# EAGLE design espurna-h (EAGLE 8.0.1)
PROJECT_AUTHOR: tinkerman.cat <xose.perez@gmail.com>; PROJECT_LICENSE: CC-BY-SA 3.0; PROJECT_NAME: ESPURNA-H; PROJECT_VERSION: 0.6.20170212
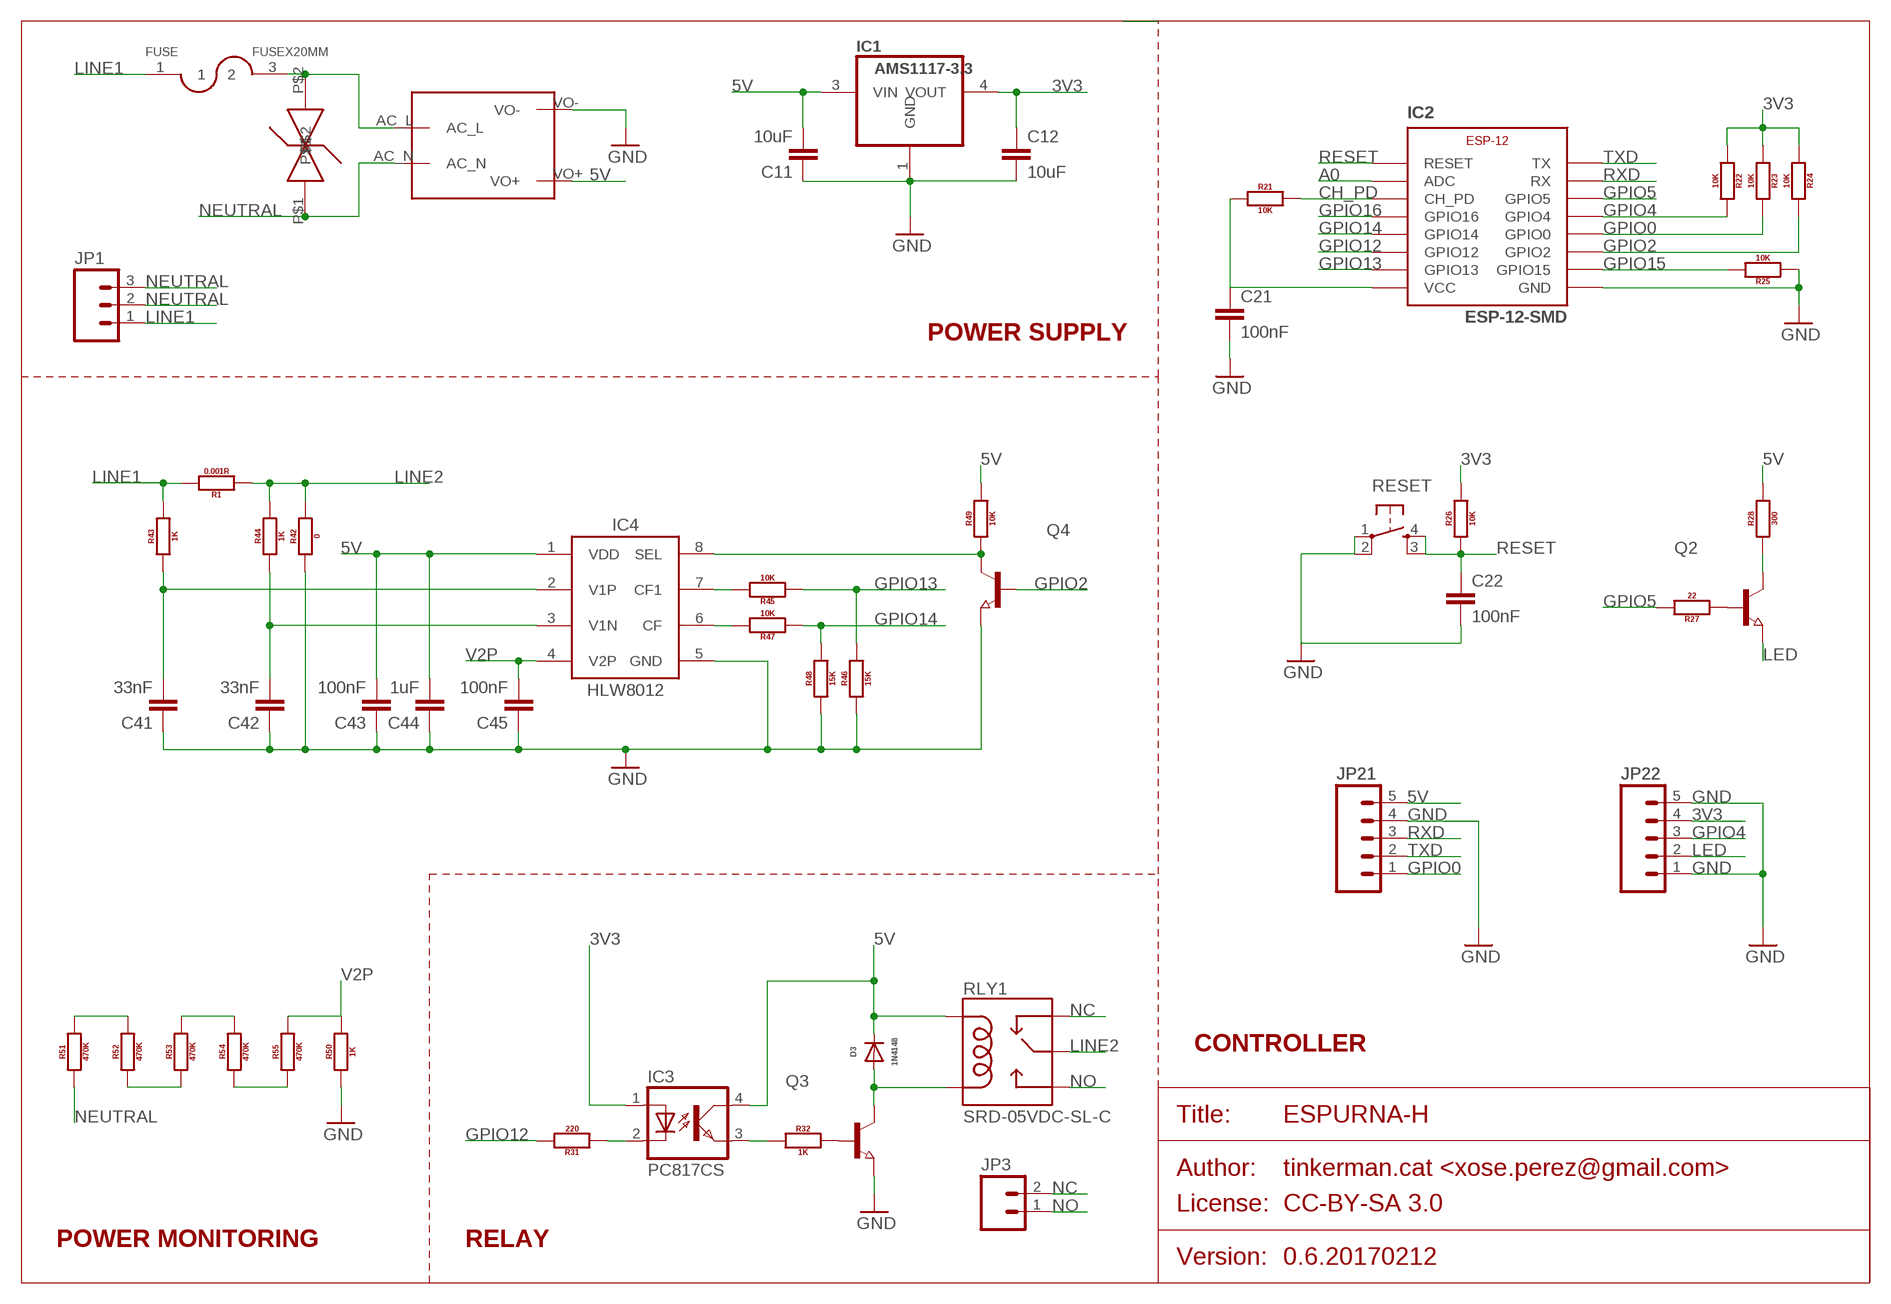
[diagram p0: schematic, sheet 1]

## Parts
C11  10uF  C-EU0805  [0805]
C12  10uF  C-EU0805  [0805]
C21  100nF  C-EU0805  [0805]
C22  100nF  C-EU0805  [0805]
C41  33nF  C-EU0805  [0805]
C42  33nF  C-EU0805  [0805]
C43  100nF  C-EU0805  [0805]
C44  1uF  C-EU0805  [0805]
C45  100nF  C-EU0805  [0805]
D3  1N4148  DIODE  [SOD80]
FUSE  FUSEX20MM  [FUSE_5MM]
IC1  AMS1117-3.3  REG1117SOT223-2  [SOT223]
IC2  ESP-12-SMD  [ESP-12-SMD]
IC3  PC817CS  SFH6186-2  [SMD4-7]
IC4  HLW8012  [SOP8]
JP1  M03200MIL  [SCREWTERMINAL-200MIL-3]
JP3  M02200MIL  [SCREWTERMINAL-200MIL-2]
JP21  M05PTH  [1X05]
JP22  M05PTH  [1X05]
Q2  NPN-TRANSISTOR_SOT23  [SOT23]
Q3  NPN-TRANSISTOR_SOT23  [SOT23]
Q4  NPN-TRANSISTOR_SOT23  [SOT23]
R1  0.001R  RESISTOR2512  [2512]
R21  10K  RESISTOR0805  [0805]
R22  10K  RESISTOR0805  [0805]
R23  10K  RESISTOR0805  [0805]
R24  10K  RESISTOR0805  [0805]
R25  10K  RESISTOR0805  [0805]
R26  10K  RESISTOR0805  [0805]
R27  22  RESISTOR0805  [0805]
R28  300  RESISTOR0805  [0805]
R31  220  RESISTOR0805  [0805]
R32  1K  RESISTOR0805  [0805]
R42  0  RESISTOR1206  [1206]
R43  1K  RESISTOR0805  [0805]
R44  1K  RESISTOR0805  [0805]
R45  10K  RESISTOR0805  [0805]
R46  15K  RESISTOR0805  [0805]
R47  10K  RESISTOR0805  [0805]
R48  15K  RESISTOR0805  [0805]
R49  10K  RESISTOR0805  [0805]
R50  1K  RESISTOR0805  [0805]
R51  470K  RESISTOR0805  [0805]
R52  470K  RESISTOR0805  [0805]
R53  470K  RESISTOR0805  [0805]
R54  470K  RESISTOR0805  [0805]
R55  470K  RESISTOR0805  [0805]
RESET  TACTILE_BUTTON_SMD  [TACTILE-BUTTON-SMD]
RLY1  SRD-05VDC-SL-C  RELAYSONGLE  [SRD-5VDC-SL-C]
U$1  MAINS_CONVERTERS  [HLK-PM01]
VARISTOR  V18ZA2P  [V18ZA2P]

## Nets
3V3: C12.1 C21.1 IC1.4(VOUT) IC2.VCC IC3.1(A) JP22.4 R21.1 R22.1 R23.1 R24.1 R26.2
5V: C11.2 C43.2 C44.2 D3.2(C) IC1.3(VIN) IC3.4(COL) IC4.1(VDD) JP21.5 R28.2 R49.2 RLY1.COIL1 U$1.VO+
A0: IC2.ADC
CH_PD: IC2.CH_PD R21.2
GND: C11.1 C12.2 C21.2 C22.2 C41.1 C42.1 C43.1 C44.1 C45.1 IC1.1(GND) IC2.GND IC4.5(GND) JP21.4 JP22.1 JP22.5 Q3.2(E) Q4.2(E) R25.1 R42.1 R46.1 R48.1 R50.1 RESET.1(SWA1) RESET.2(SWB1) U$1.VO-
GPIO0: IC2.GPIO0 JP21.1 R23.2
GPIO2: IC2.GPIO2 Q4.1(B) R24.2
GPIO4: IC2.GPIO4 JP22.3 R22.2
GPIO5: IC2.GPIO5 R27.2
GPIO12: IC2.GPIO12 R31.2
GPIO13: IC2.GPIO13 R45.1 R46.2
GPIO14: IC2.GPIO14 R47.1 R48.2
GPIO15: IC2.GPIO15 R25.2
GPIO16: IC2.GPIO16
LED: JP22.2 Q2.2(E)
LINE1: FUSE.1 JP1.1 R1.2 R43.2
LINE2: R1.1 R42.2 R44.2 RLY1.COMMON(MAIN)
N$1: Q2.3(C) R28.1
N$3: Q2.1(B) R27.1
N$4: D3.1(A) Q3.3(C) RLY1.COIL2
N$5: Q3.1(B) R32.2
N$6: IC3.3(EMIT) R32.1
N$8: FUSE.3 U$1.AC_L VARISTOR.P$2
N$10: IC4.8(SEL) Q4.3(C) R49.1
N$11: IC4.7(CF1) R45.2
N$12: C41.2 IC4.2(V1P) R43.1
N$13: IC4.6(CF) R47.2
N$14: C42.2 IC4.3(V1N) R44.1
N$15: IC3.2(C) R31.1
N$16: R54.1 R55.1
N$17: R53.2 R54.2
N$18: R52.1 R53.1
N$19: R51.2 R52.2
NC: JP3.2 RLY1.CLOSED(NC)
NEUTRAL: JP1.2 JP1.3 R51.1 U$1.AC_N VARISTOR.P$1
NO: JP3.1 RLY1.OPEN(NO)
RESET: C22.1 IC2.RESET R26.1 RESET.3(SWB2) RESET.4(SWA2)
RXD: IC2.RX JP21.3
TXD: IC2.TX JP21.2
V2P: C45.2 IC4.4(V2P) R50.2 R55.2

## Notes on the sheet
- POWER SUPPLY
- CONTROLLER
- POWER MONITORING | RELAY

## Library data of the parts
C11 C12 C21 C22 C41-C45 = xose:C-EU: CAPACITOR, European symbol
D3 = xose:DIODE
FUSE = xose:FUSE
IC1 = xose:REG1117: 800mA and 1A Low Dropout (LDO) Positive Regulator 1.8V, 2.5V, 2.85V, 3.3V, 5V, and Adj
IC2 = xose:ESP-12
IC3 = optocoupler:SFH618?*: Optocoupler, Phototransistor Output, Low Input Current Source: Data sheet <http://www.vishay.com/docs/83673/sfh618.pdf>; MF: VISHAY/TELEFUNKEN; MPN: SFH6186-2; OC_FARNELL: 1469583; OC_NEWARK: 58K2210
IC4 = xose:HLW8012
JP1 = xose:M03: Header 3 Standard 3-pin 0.1" header. Use with straight break away headers (SKU : PRT-00116), right angle break away headers (PRT-00553), swiss pins (PRT-00743), machine pins (PRT-00117), and female headers (PRT-00115). Molex polarized connector foot print use with SKU : PRT-08232 with associated crimp pins and housings.
JP3 = xose:M02: Standard 2-pin 0.1" header. Use with - straight break away headers ( PRT-00116) - right angle break away headers (PRT-00553) - swiss pins (PRT-00743) - machine pins (PRT-00117) - female headers (PRT-00115) Molex polarized connector foot print use with: PRT-08233 with associated crimp pins and housings. 2.54_SCREWTERM for use with PRT-10571. 3.5mm Screw Terminal footprints for PRT-08084 5mm Screw Terminal footprints for use with PRT-08432
JP21 JP22 = xose:M05: Header 5 Standard 5-pin 0.1" header. Use with straight break away headers (SKU : PRT-00116), right angle break away headers (PRT-00553), swiss pins (PRT-00743), machine pins (PRT-00117), and female headers (PRT-00115). Molex polarized connector foot print use with SKU : PRT-08230 with associated crimp pins and housings.
Q2-Q4 = xose:NPN-TRANSISTOR_: NPN TRANSISTOR
R1 R21-R28 R31 R32 R42-R55 = xose:RESISTOR: Generic EU resistor symbol
RESET = xose:TACTILE_BUTTON: Tactile Button SparkFun Electronics' Tactile Button COM-10302
RLY1 = Spark:RELAY: SPDT relay (COM-00101)
U$1 = captain-slow:MAINS_CONVERTERS
VARISTOR = SparkFun-DiscreteSemi:V18ZA2P: Varistor

## Board
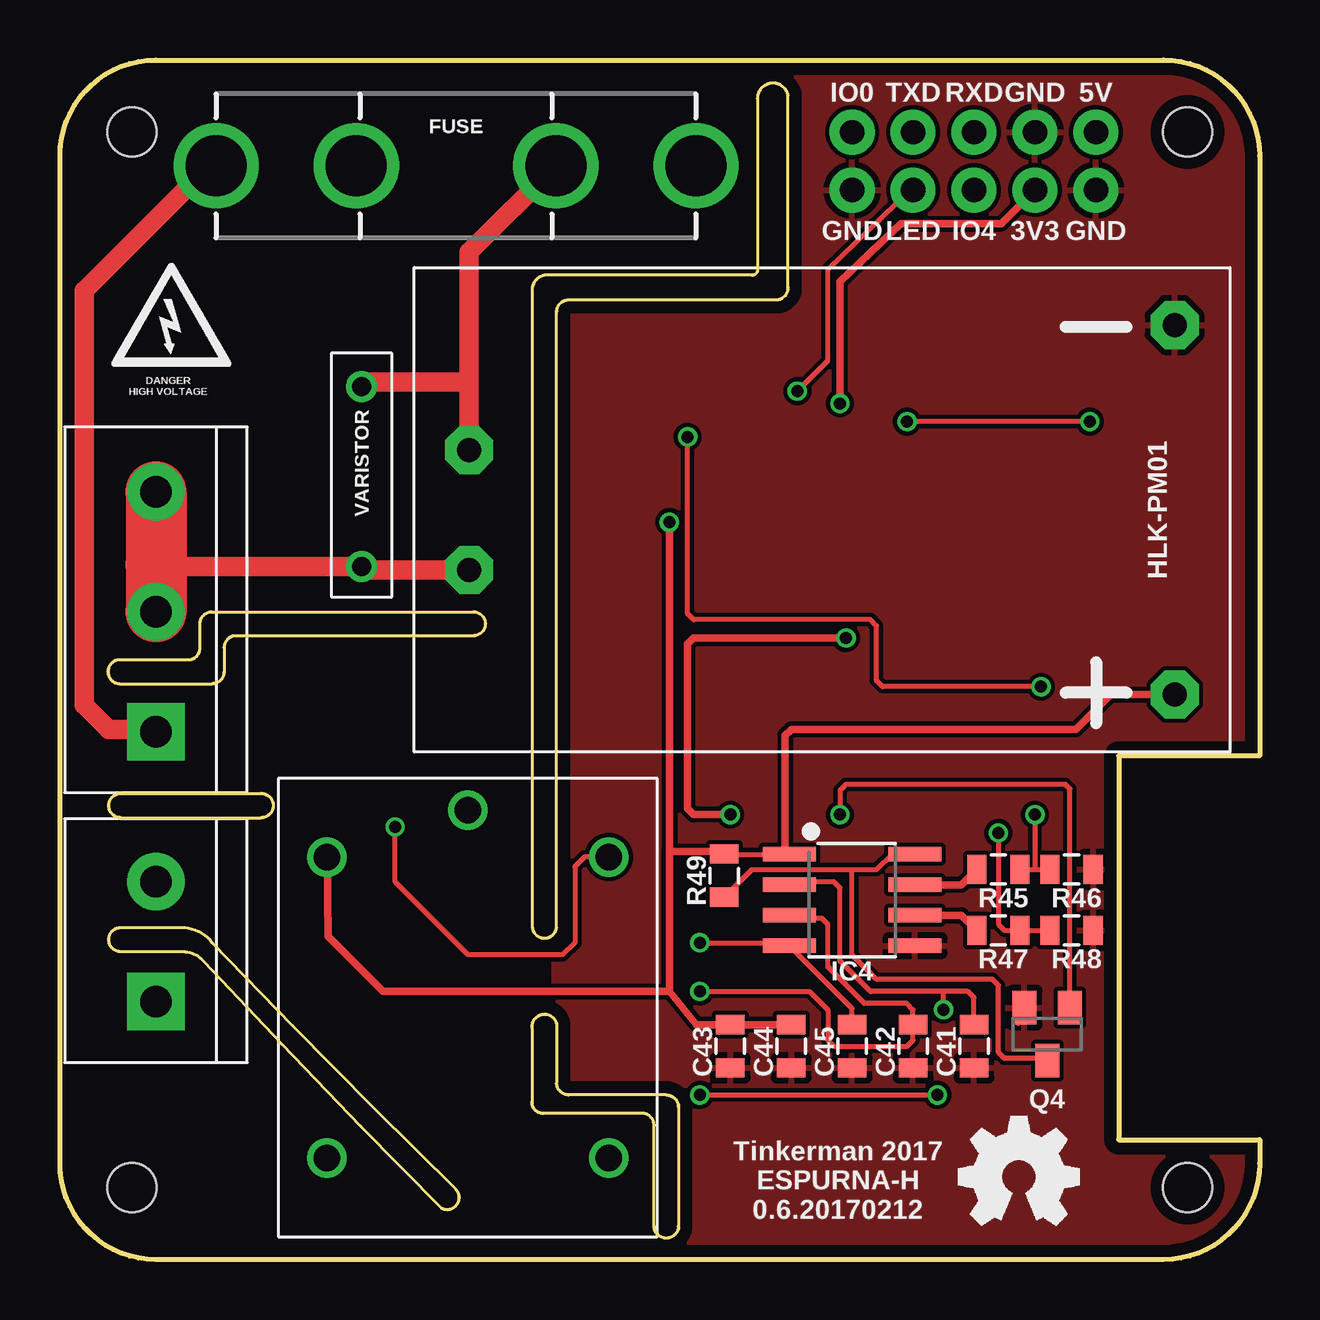
[diagram p1: board, top side]
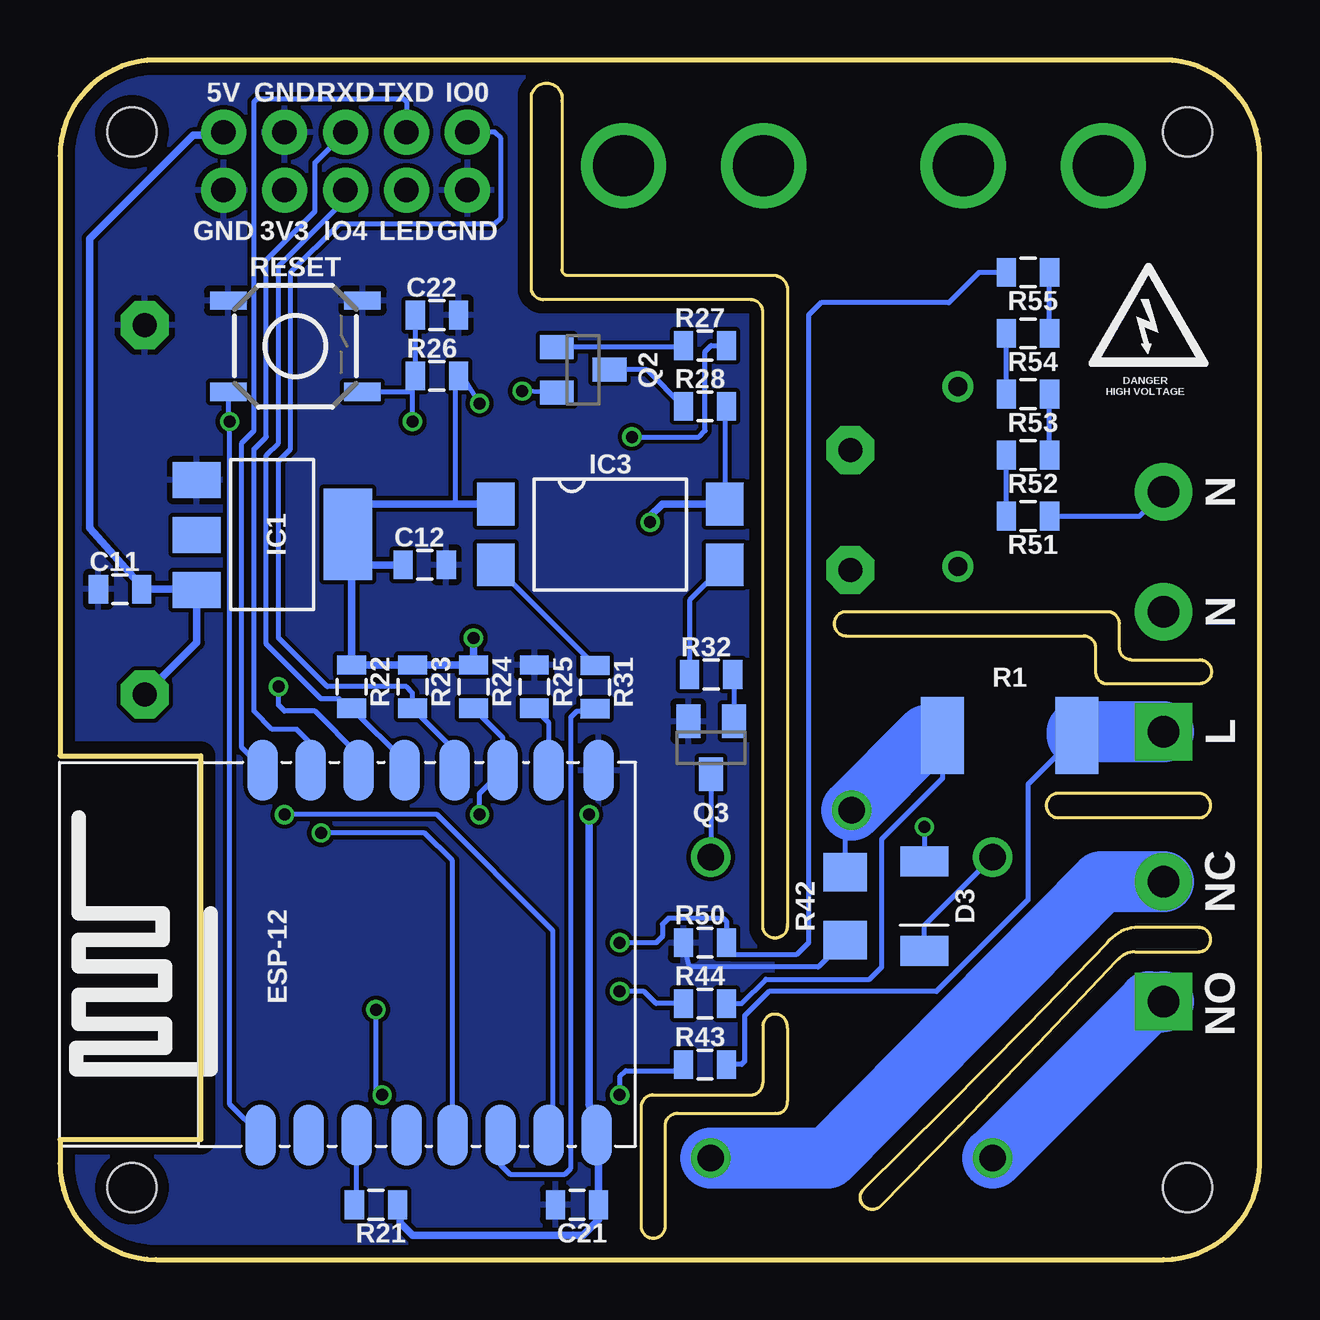
[diagram p2: board, bottom side, seen from below]

Size 50 x 50 mm. Coordinates in mm from the lower left corner, seen from the top.
Outline: 0,4 0,46 arc-90 4,50 46,50 arc-90 50,46 50,21 44.13,21 44.13,5 50,5 50,4 arc-90 46,0 4,0 arc-90 0,4
Outline: 5.21,12.83 arc-46 5.97,12.45 arc2 15.88,2.16 arc164 16.51,2.92 arc-2 6.35,13.21 arc44 5.21,13.84 2.54,13.84 arc180 2.54,12.83 5.21,12.83
Outline: 2.54,18.41 8.38,18.41 arc180 8.38,19.43 2.54,19.43 arc180 2.54,18.41
Outline: 2.5,24 6.34,24 arc90 6.84,24.5 6.84,25.5 arc-90 7.34,26 17.23,26 arc90 17.73,26.5 arc90 17.23,27 6.34,27 arc90 5.84,26.5 5.84,25.5 arc-90 5.34,25 2.5,25 arc180 2.5,24
Outline: 19.68,13.97 arc180 20.7,13.84 20.7,39.5 arc-90 21.21,40.01 29.84,40.01 arc90 30.35,40.51 30.35,48.51 arc180 29.08,48.26 29.08,41.27 arc-90 28.83,41.02 20.19,41.02 arc74 19.68,40.51 19.68,13.97
Outline: 19.68,9.65 arc-180 20.7,9.78 20.7,7.37 arc90 21.21,6.86 25.27,6.86 arc-90 25.78,6.35 25.78,1.4 arc-180 24.77,1.4 24.77,5.59 arc90 24.26,6.1 20.19,6.1 arc-106 19.68,6.6 19.68,9.65
Copper layers (1*16): Top 0.035mm / dielectric 1.5mm / Bottom 0.035mm
Design rules "smart-prototyping": minimum track width 7mil, minimum drill 12mil, track to track 7mil, track to pad 7mil, pad to pad 7mil, via to via 7mil, smd to smd 0mil, copper to edge 20mil, drill to drill 10mil, minimum pad ring 10mil, minimum via ring 6mil, stop-mask expansion 2mil, vias tented up to drill 25mil, thermal gap 10mil
Holes 2.03 mm at 3,3 47,3 47,47 3,47

### Footprints (pad centres in the part's own frame; a part is rotated, then mirrored left to right if it is on the bottom)
0805 = smd 0.8 x 1.2: 1 -0.9,0; 2 0.9,0
SOD80 = smd 1.25 x 2: 1 -1.872,0; 2 1.872,0
FUSE_5MM = drill 2.54 pad 3.556: 1 0,-10; 2 0,-4.158; 3 0,4.158; 4 0,10
SOT223 = smd 1.499 x 2.007: 1 -2.261,-3.15; 2 0.025,-3.15; 3 2.311,-3.15 | smd 3.81 x 2.007: 4 0,3.15
ESP-12-SMD = smd 2.54 x 1.27: ADC -7,5.1; CH_PD -7,3.1; GND 8.2,-7; GPIO0 8.2,-1; GPIO2 8.2,-3; GPIO4 8.2,1.1; GPIO5 8.2,3; GPIO12 -7,-2.9; GPIO13 -7,-4.9; GPIO14 -7,-0.9; GPIO15 8.2,-4.9; GPIO16 -7,1; RESET -7,7.1; RX 8.2,5; TX 8.2,7; VCC -7,-6.9
SMD4-7 = smd 1.78 x 1.55: 1 -1.27,-4.77; 2 1.27,-4.77; 3 1.27,4.77; 4 -1.27,4.77
SOP8 = smd 0.61 x 2.21: 1 0.381,-0.838; 2 1.651,-0.838; 3 2.921,-0.838; 4 4.191,-0.838; 5 4.191,4.394; 6 2.921,4.394; 7 1.651,4.394; 8 0.381,4.394
SCREWTERMINAL-200MIL-3 = drill 1.3 pad 2.413 square: 1 0,0 | drill 1.3 pad 2.413: 2 5,0; 3 10,0
SCREWTERMINAL-200MIL-2 = drill 1.3 pad 2.413 square: 1 0,0 | drill 1.3 pad 2.413: 2 5,0
1X05 = drill 1.016 pad 1.88: 1 0,0; 2 2.54,0; 3 5.08,0; 4 7.62,0; 5 10.16,0
SOT23 = smd 1 x 1.4: 1 -0.95,-1.1; 2 0.95,-1.1; 3 0,1.1
2512 = smd 1.8 x 3.2: 1 -2.8,0; 2 2.8,0
1206 = smd 1.6 x 1.803: 1 -1.422,0; 2 1.422,0
TACTILE-BUTTON-SMD = smd 1.524 x 0.762: 1 -2.794,1.905; 2 2.794,1.905; 3 -2.794,-1.905; 4 2.794,-1.905
SRD-5VDC-SL-C = drill 1.1: CLOSED -6.275,-5.875; COIL1 6.275,5.875; COIL2 6.275,-5.875; COMMON 8.225,0; OPEN -6.275,5.875
HLK-PM01 = drill 1 pad 2 octagon: AC_L -14.7,2.5; AC_N -14.7,-2.5; VO+ 14.7,-7.7; VO- 14.7,7.7
V18ZA2P = drill 0.8: P$1 0,0; P$2 7.5,0

### Placement (x,y rotation side)
C11  47.5,27.94 0 bottom
C12  34.8,28.96 0 bottom
C21  28.45,2.29 180 bottom
C22  34.29,39.37 0 bottom
C41  38.1,8.89 90 top
C42  35.56,8.89 90 top
C43  27.94,8.89 90 top
C44  30.48,8.89 90 top
C45  33.02,8.89 90 top
D3  13.97,14.73 270 bottom
FUSE  16.51,45.59 270 top
IC1  41.15,30.23 270 bottom
IC2  34.54,12.19 90 bottom
IC3  27.06,30.22 270 bottom
IC4  31.24,17.27 270 top
JP1  4,22 90 top
JP3  4,10.75 90 top
JP21  33.02,46.99 0 top
JP22  33.02,44.58 0 top
Q2  28.19,37.08 270 bottom
Q3  22.86,21.34 180 bottom
Q4  41.15,9.4 180 top
R1  10.41,21.84 0 bottom
R21  36.83,2.29 180 bottom
R22  37.85,23.88 270 bottom
R23  35.31,23.88 270 bottom
R24  32.77,23.88 270 bottom
R25  30.23,23.88 270 bottom
R26  34.29,36.83 0 bottom
R27  23.11,38.1 0 bottom
R28  23.11,35.56 0 bottom
R31  27.69,23.86 270 bottom
R32  22.86,24.38 0 bottom
R42  17.27,14.73 90 bottom
R43  23.11,8.13 0 bottom
R44  23.11,10.67 0 bottom
R45  39.12,16.26 180 top
R46  42.16,16.26 180 top
R47  39.12,13.72 180 top
R48  42.16,13.72 180 top
R49  27.69,16 90 top
R50  23.11,13.21 0 bottom
R51  9.65,30.99 180 bottom
R52  9.65,33.53 180 bottom
R53  9.65,36.07 180 bottom
R54  9.65,38.61 180 bottom
R55  9.65,41.15 180 bottom
RESET  40.19,38.07 0 bottom
RLY1  17,10.5 90 top
U$1  31.76,31.25 0 top
VARISTOR  12.57,28.89 90 top

### Tracks (layer width: path | path; a pad name or v marks a point on that pad's centre or on a via)
3V3  (via drill 0.5)
  Top 0.305: v27.94,18.54 26.42,18.54 26.16,18.8 26.16,25.65 26.42,25.91 v32.77,25.91 | v32.51,35.69 32.51,40.77 35.05,43.18 39.24,43.18 JP22.4
  Bottom 0.203: 33.53,31.5 33.53,37.2 R26.2 33.39,37.07 v32.51,35.69
  Bottom 0.305: R21.1 35.81,2.17 35.81,1.52 35.31,1.02 28.19,1.02 27.55,1.66 C21.1 27.55,5.1 IC2.VCC 27.94,6.5 v27.94,18.54 | 37.85,28.96 37.85,29.31 IC1.4 38.76,31.5 33.53,31.5 IC3.1 | 37.85,28.96 R22.1 R23.1 R24.1 v32.77,25.91 | C12.1 37.85,28.96
5V  (via drill 0.5)
  Top 0.203: 27.57,17.02 R49.2 IC4.1
  Top 0.305: RLY1.COIL1 11.18,13.46 13.46,11.18 25.4,11.18 | 25.4,11.18 25.4,17.02 | 25.4,17.02 27.57,17.02 | C44.2 C43.2 26.53,9.79 25.4,11.18 | v25.4,30.73 25.4,17.02 | IC4.1 30.23,17.07 30.23,21.84 30.48,22.1 42.34,22.1 43.8,23.55 U$1.VO+
  Bottom 0.203: D3.2 13.97,13.93 RLY1.COIL1 | R28.2 22.29,35.48 IC3.4
  Bottom 0.305: U$1.VO+ 44.3,25.71 IC1.3 44.32,27.94 C11.2 46.6,28.06 48.77,30.48 48.77,42.55 44.45,46.86 43.31,46.86 JP21.5 | IC3.4 24.89,31.5 25.4,30.99 v25.4,30.73
CH_PD
  Bottom 0.203: R21.2 37.64,2.37 IC2.CH_PD
GND
  Top 0.203: 39.94,9.83 Q4.2 | 43.06,13.62 R48.1
  Bottom 0.203: R50.1 23.76,12.19 18.39,12.19 R42.1
  pour Bottom: 29.46,50.04 29.72,40.64 20.32,40.64 20.32,6.6 25.15,6.6 25.15,-0.25 50.8,-0.25 50.8,50.29 29.46,50.29
  pour Top: 29.72,50.04 29.97,40.64 20.57,40.64 20.57,6.6 25.4,6.6 25.4,-0.25 51.05,-0.25 51.05,50.29 29.72,50.29
GPIO0
  Bottom 0.203: IC2.GPIO0 33.54,21.21 R23.2 35.31,23.62 35.56,23.88 38.86,23.88 40.89,25.91 40.89,33.27 40.39,33.78 40.39,41.15 38.35,43.18 31.88,43.18 31.62,43.43 31.62,46.74 31.88,46.99 JP21.1
GPIO2  (via drill 0.5)
  Top 0.203: Q4.1 42.1,19.62 41.91,19.81 32.77,19.81 32.51,19.56 v32.51,18.54
  Bottom 0.203: R24.2 31.54,21.75 IC2.GPIO2 32.51,19.42 v32.51,18.54
GPIO4
  Bottom 0.203: IC2.GPIO4 35.64,20.77 R22.2 37.96,22.98 38.35,23.37 39.12,23.37 41.4,25.65 41.4,33.53 40.89,34.04 40.89,41.4 38.1,44.2 JP22.3
GPIO5  (via drill 0.5)
  Top 0.203: v40.89,23.88 34.29,23.88 34.04,24.13 34.04,26.42 33.78,26.67 26.42,26.67 26.16,26.92 v26.16,34.29
  Bottom 0.203: IC2.GPIO5 37.54,21.03 39.37,22.86 40.64,22.86 40.89,23.11 v40.89,23.88 | v26.16,34.29 23.37,34.29 23.11,34.54 23.11,37.85 22.86,38.1 R27.2
GPIO12
  Bottom 0.203: IC2.GPIO12 31.64,3.96 31.24,3.56 28.96,3.56 28.7,3.81 28.7,22.61 28.45,22.86 27.79,22.86 R31.2
GPIO13  (via drill 0.5)
  Top 0.203: R45.1 40.64,16.26 | 40.64,16.26 R46.2 | v40.64,18.54 40.64,16.26
  Bottom 0.203: v40.64,18.54 34.29,18.54 29.46,13.72 29.46,5.37 IC2.GPIO13
GPIO14  (via drill 0.5)
  Top 0.203: v39.12,17.78 39.12,13.97 39.37,13.72 R47.1 R48.2
  Bottom 0.203: IC2.GPIO14 33.64,16.63 34.8,17.78 v39.12,17.78
GPIO15
  Bottom 0.203: R25.2 29.64,22.39 IC2.GPIO15
LED  (via drill 0.5)
  Top 0.203: v30.73,36.2 32,37.47 32,41.27 35.43,44.58 JP22.2
  Bottom 0.203: Q2.2 v30.73,36.2
LINE1
  Top 0.813: FUSE.1 6.26,45.63 1.02,40.39 1.02,23.11 2.03,22.1 3.9,22.1 JP1.1
  Bottom 0.203: R1.2 9.65,19.81 9.65,14.99 13.46,11.18 20.45,11.18 21.46,10.16 21.46,8.26 21.59,8.13 R43.2
  Bottom 2.54: JP1.1 7.61,22 R1.2
LINE2
  Bottom 0.203: 13.88,21.84 R1.1 13.21,20.07 15.75,17.53 15.75,12.19 16.26,11.68 20.57,11.68 21.59,10.67 R44.2 | RLY1.COMMON 17.27,18.45 R42.2
  Bottom 2.54: 13.88,21.84 RLY1.COMMON
N$1
  Bottom 0.203: R28.1 25.54,37.08 Q2.3
N$3
  Bottom 0.203: R27.1 24.08,38.03 Q2.1
N$4  (via drill 0.5)
  Top 0.203: RLY1.COIL2 21.86,16.77 21.46,16.38 21.46,13.21 20.95,12.7 17.02,12.7 13.97,15.75 v13.97,18.03
  Bottom 0.203: v13.97,18.03 D3.1 | Q3.3 22.88,20.22 RLY1.COIL2
N$5
  Bottom 0.203: R32.2 21.91,24.33 Q3.1
N$6
  Bottom 0.203: IC3.3 23.76,27.48 R32.1
N$8
  Top 0.813: FUSE.3 17.06,41.99 17.06,36.58 | 17.06,36.58 U$1.AC_L | VARISTOR.P$2 12.76,36.58 17.06,36.58
N$10
  Top 0.203: R49.1 28.84,16.26 33.02,16.26 | 33.02,16.26 34.04,16.26 34.67,16.89 IC4.8 | Q4.3 41.06,8.38 39.37,8.38 39.12,8.64 39.12,11.43 38.86,11.68 34.04,11.68 33.02,12.7 33.02,16.26
N$11
  Top 0.305: R45.2 37.58,15.62 IC4.7
N$12  (via drill 0.5)
  Top 0.203: C41.2 38.1,10.92 37.85,11.18 36.83,11.18 | IC4.2 30.53,15.75 32.26,15.75 32.51,15.49 32.51,12.45 33.78,11.18 36.83,11.18 | v26.67,6.86 v36.58,6.86 | v36.83,10.41 36.83,11.18
  Bottom 0.203: v26.67,6.86 26.67,7.62 26.42,7.87 24.38,7.87 24.13,8.13 R43.1 | v36.58,6.86 36.83,7.11 v36.83,10.41
N$13
  Top 0.305: IC4.6 37.58,14.35 R47.2
N$14  (via drill 0.5)
  Top 0.203: v26.67,11.18 31.24,11.18 32,10.41 32,9.14 32.26,8.89 35.31,8.89 35.56,9.14 C42.2 35.56,10.41 35.31,10.67 33.53,10.67 32,12.19 32,13.97 31.75,14.22 30.53,14.22 IC4.3 30.86,14.35
  Bottom 0.203: R44.1 25.15,10.67 25.65,11.18 v26.67,11.18
N$15
  Bottom 0.203: R31.1 31.83,28.89 IC3.2
N$16
  Bottom 0.203: R54.1 R55.1
N$17
  Bottom 0.203: R53.2 R54.2
N$18
  Bottom 0.203: R52.1 R53.1
N$19
  Bottom 0.203: R51.2 R52.2
NC
  Bottom 2.54: JP3.2 6.6,15.75 18,4.22 RLY1.CLOSED
NEUTRAL
  Top 0.813: U$1.AC_N 12.71,28.75 VARISTOR.P$1 4.07,28.89 4,28.96
  Top 2.54: JP1.3 4,28.96 JP1.2
  Bottom 0.203: R51.1 5.01,30.99 JP1.3
NO
  Bottom 2.54: RLY1.OPEN 4.6,10.75 JP3.1
RESET  (via drill 0.5)
  Top 0.203: v42.93,34.92 v35.31,34.92
  Bottom 0.203: C22.1 R26.1 | R26.1 35.35,36.16 RESET.4 | IC2.RESET 42.93,6.47 v42.93,34.92 42.98,35.36 RESET.3 | v35.31,34.92 35.31,37.22 R26.1
RXD
  Bottom 0.203: IC2.RX 39.54,21.51 40.13,22.1 41.15,22.1 41.91,22.86 41.91,33.78 41.4,34.29 41.4,41.66 39.37,43.69 39.37,45.72 JP21.3
TXD
  Bottom 0.203: IC2.TX 41.54,20.46 42.42,21.34 42.42,34.04 41.91,34.54 41.91,48.26 41.78,48.39 35.69,48.39 35.56,48.26 JP21.2
V2P  (via drill 0.5)
  Top 0.203: C45.2 33.02,10.46 IC4.4 30.28,13.21 v26.67,13.21
  Bottom 0.203: R55.2 11.68,41.15 12.95,39.88 18.29,39.88 18.8,39.37 18.8,13.21 19.3,12.7 21.96,12.7 R50.2 | R50.2 22.1,13.32 | R50.2 22.21,14.09 22.35,14.22 24.64,14.22 24.89,13.97 24.89,13.46 25.15,13.21 v26.67,13.21

### Text on the board
tPlace: IO0 | TXD | RXD | GND | 5V | GND | LED | IO4 | 3V3 | GND
bPlace: IO0 | TXD | RXD | GND | 5V | GND | LED | IO4 | 3V3 | GND | N | N | L | NC | NO
tNames: FUSE | DANGER / HIGH VOLTAGE | VARISTOR | Tinkerman 2017 / ESPURNA-H / 0.6.20170212
bNames: DANGER / HIGH VOLTAGE